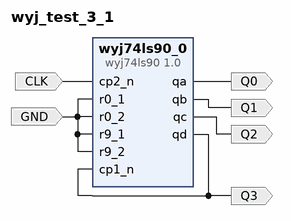
[diagram p0: block diagram of the top level]
# Vivado block design wyj_test_3_1, xc7a35tcsg324-1, Vivado 2024.2
create_bd_design wyj_test_3_1

create_bd_port -dir I GND
create_bd_port -dir I CLK
create_bd_port -dir O Q0
create_bd_port -dir O Q1
create_bd_port -dir O Q2
create_bd_port -dir O Q3

create_bd_cell -type ip -vlnv xilinx.com:uip:wyj74ls90:1.0 wyj74ls90_0

# ---- connections ----

connect_bd_net [get_bd_ports CLK] [get_bd_pins wyj74ls90_0/cp2_n]
connect_bd_net [get_bd_ports GND] \
  [get_bd_pins wyj74ls90_0/r0_1] [get_bd_pins wyj74ls90_0/r0_2] [get_bd_pins wyj74ls90_0/r9_1] [get_bd_pins wyj74ls90_0/r9_2]
connect_bd_net [get_bd_pins wyj74ls90_0/qa] [get_bd_ports Q0]
connect_bd_net [get_bd_pins wyj74ls90_0/qb] [get_bd_ports Q1]
connect_bd_net [get_bd_pins wyj74ls90_0/qc] [get_bd_ports Q2]
connect_bd_net [get_bd_pins wyj74ls90_0/qd] [get_bd_ports Q3] [get_bd_pins wyj74ls90_0/cp1_n]

validate_bd_design
save_bd_design
